# EAGLE design Main Circuit (EAGLE 9.4.2)
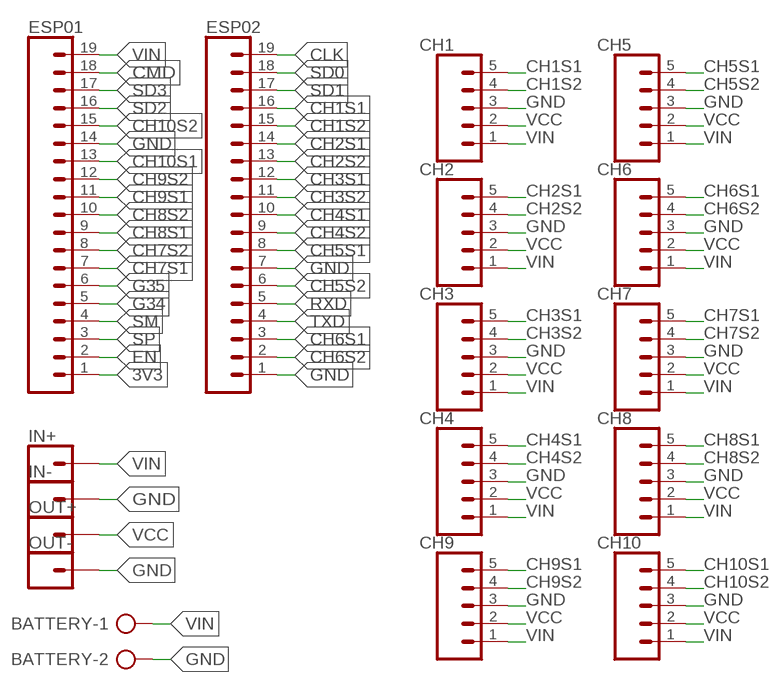
[diagram p0: schematic, sheet 1]

## Parts
BATTERY  AK500/2-H  [AK500/2-H]
CH1  CONN_05  [1X05]
CH2  CONN_05  [1X05]
CH3  CONN_05  [1X05]
CH4  CONN_05  [1X05]
CH5  CONN_05  [1X05]
CH6  CONN_05  [1X05]
CH7  CONN_05  [1X05]
CH8  CONN_05  [1X05]
CH9  CONN_05  [1X05]
CH10  CONN_05  [1X05]
ESP01  CONN_19  [1X19]
ESP02  CONN_19  [1X19]
IN+  CONN_01  [1X01]
IN-  CONN_01  [1X01]
OUT+  CONN_01  [1X01]
OUT-  CONN_01  [1X01]

## Nets
3V3: ESP01.1
CH1S1: CH1.5 ESP02.16
CH1S2: CH1.4 ESP02.15
CH2S1: CH2.5 ESP02.14
CH2S2: CH2.4 ESP02.13
CH3S1: CH3.5 ESP02.12
CH3S2: CH3.4 ESP02.11
CH4S1: CH4.5 ESP02.10
CH4S2: CH4.4 ESP02.9
CH5S1: CH5.5 ESP02.8
CH5S2: CH5.4 ESP02.6
CH6S1: CH6.5 ESP02.3
CH6S2: CH6.4 ESP02.2
CH7S1: CH7.5 ESP01.7
CH7S2: CH7.4 ESP01.8
CH8S1: CH8.5 ESP01.9
CH8S2: CH8.4 ESP01.10
CH9S1: CH9.5 ESP01.11
CH9S2: CH9.4 ESP01.12
CH10S1: CH10.5 ESP01.13
CH10S2: CH10.4 ESP01.15
CLK: ESP02.19
CMD: ESP01.18
EN: ESP01.2
G34: ESP01.5
G35: ESP01.6
GND: BATTERY.2 CH1.3 CH2.3 CH3.3 CH4.3 CH5.3 CH6.3 CH7.3 CH8.3 CH9.3 CH10.3 ESP01.14 ESP02.1 ESP02.7 IN-.1 OUT-.1
RXD: ESP02.5
SD0: ESP02.18
SD1: ESP02.17
SD2: ESP01.16
SD3: ESP01.17
SM: ESP01.4
SP: ESP01.3
TXD: ESP02.4
VCC: CH1.2 CH2.2 CH3.2 CH4.2 CH5.2 CH6.2 CH7.2 CH8.2 CH9.2 CH10.2 OUT+.1
VIN: BATTERY.1 CH1.1 CH2.1 CH3.1 CH4.1 CH5.1 CH6.1 CH7.1 CH8.1 CH9.1 CH10.1 ESP01.19 IN+.1

## Library data of the parts
BATTERY = con-ptr500:AK500/2-H: CONNECTOR Aug. 2004 / PTR Meßtechnik: Die Bezeichnung der Serie AK505 wurde geändert. Es handelt sich hierbei um AK500 in horizontaler Ausführung.; OC_FARNELL: unknown; OC_NEWARK: unknown
CH1-CH10 = SparkFun-Connectors:CONN_05: Multi connection point. Often used as Generic Header-pin footprint for 0.1 inch spaced/style header connections On any of the 0.1 inch spaced packages, you can populate with these: Break Away Headers - Straight <https://www.sparkfun.com/products/116> (PRT-00116) Break Away Male Headers - Right Angle <https://www.sparkfun.com/products/553> (PRT-00553) Female Headers <https://www.sparkfun.com/products/115> (PRT-00115) Break Away Headers - Machine Pin <https://www.sparkfun.com/products/117> (PRT-00117) Break Away Female Headers - Swiss Machine Pin <https://www.sparkfun.com/products/743> (PRT-00743) For SCREWTERMINALS and SPRING TERMINALS visit here: Screw Terimnals on SparkFun.com <https://www.sparkfun.com/search/results?term=Screw+Terminals> (5mm/3.5mm/2.54mm spacing) This device is also useful as a general connection point to wire up your design to another part of your project. Our various solder wires solder well into these plated through hole pads. Hook-Up Wire - Assortment (Stranded, 22 AWG) <https://www.sparkfun.com/products/11375> (PRT-11375) Hook-Up Wire - Assortment (Solid Core, 22 AWG) <https://www.sparkfun.com/products/11367> (PRT-11367) View the entire wire category on our website here <https://www.sparkfun.com/categories/141> Special notes: Molex polarized connector foot print use with SKU : PRT-08231 with associated crimp pins and housings. 1MM SMD Version SKU: PRT-10208
ESP01 ESP02 = SparkFun-Connectors:CONN_19: Multi connection point. Often used as Generic Header-pin footprint for 0.1 inch spaced/style header connections On any of the 0.1 inch spaced packages, you can populate with these: Break Away Headers - Straight <https://www.sparkfun.com/products/116> (PRT-00116) Break Away Male Headers - Right Angle <https://www.sparkfun.com/products/553> (PRT-00553) Female Headers <https://www.sparkfun.com/products/115> (PRT-00115) Break Away Headers - Machine Pin <https://www.sparkfun.com/products/117> (PRT-00117) Break Away Female Headers - Swiss Machine Pin <https://www.sparkfun.com/products/743> (PRT-00743) For SCREWTERMINALS and SPRING TERMINALS visit here: Screw Terimnals on SparkFun.com <https://www.sparkfun.com/search/results?term=Screw+Terminals> (5mm/3.5mm/2.54mm spacing) This device is also useful as a general connection point to wire up your design to another part of your project. Our various solder wires solder well into these plated through hole pads. Hook-Up Wire - Assortment (Stranded, 22 AWG) <https://www.sparkfun.com/products/11375> (PRT-11375) Hook-Up Wire - Assortment (Solid Core, 22 AWG) <https://www.sparkfun.com/products/11367> (PRT-11367) View the entire wire category on our website here <https://www.sparkfun.com/categories/141> Special notes: Molex polarized connector foot print use with SKU : PRT-08231 with associated crimp pins and housings. 1MM SMD Version SKU: PRT-10208 NOTES ON THE VARIANTS LOCK and LOCK_LONGPADS... This footprint was designed to help hold the alignment of a through-hole component (i.e. 6-pin header) while soldering it into place. You may notice that each hole has been shifted either up or down by 0.005 of an inch from it's more standard position (which is a perfectly straight line). This slight alteration caused the pins (the squares in the middle) to touch the edges of the holes. Because they are alternating, it causes a "brace" to hold the component in place. 0.005 has proven to be the perfect amount of "off-center" position when using our standard breakaway headers. Although looks a little odd when you look at the bare footprint, once you have a header in there, the alteration is very hard to notice. Also,if you push a header all the way into place, it is covered up entirely on the bottom side.
IN+ IN- OUT+ OUT- = SparkFun-Connectors:CONN_01: Single connection point. Often used as Generic Header-pin footprint for 0.1 inch spaced/style header connections On any of the 0.1 inch spaced packages, you can populate with these: Break Away Headers - Straight <https://www.sparkfun.com/products/116> (PRT-00116) Break Away Male Headers - Right Angle <https://www.sparkfun.com/products/553> (PRT-00553) Female Headers <https://www.sparkfun.com/products/115> (PRT-00115) Break Away Headers - Machine Pin <https://www.sparkfun.com/products/117> (PRT-00117) Break Away Female Headers - Swiss Machine Pin <https://www.sparkfun.com/products/743> (PRT-00743) This device is also useful as a general connection point to wire up your design to another part of your project. Our various solder wires solder well into these plated through hole pads. Hook-Up Wire - Assortment (Stranded, 22 AWG) <https://www.sparkfun.com/products/11375> (PRT-11375) Hook-Up Wire - Assortment (Solid Core, 22 AWG) <https://www.sparkfun.com/products/11367> (PRT-11367) View the entire wire category on our website here <https://www.sparkfun.com/categories/141> Special notes: SMTSO-256-ET is a "flush mount" nut for a 4-40 screw. We mostly use this on specialty testbeds; it is a nice way to connect hardware to your PCB at an adjustable hieght. Also note, the SNAP packages are for using a snappable style connector. We sell a baggie of snaps and they are also used on two LilyPad designs: Snap Assortment - 30 pack (male and female) <https://www.sparkfun.com/products/11347> (DEV-11347) LilyPad Arduino SimpleSnap <https://www.sparkfun.com/products/10941> (DEV-10941) LilyPad SimpleSnap Protoboard <https://www.sparkfun.com/products/10940> (DEV-10940)

## Board
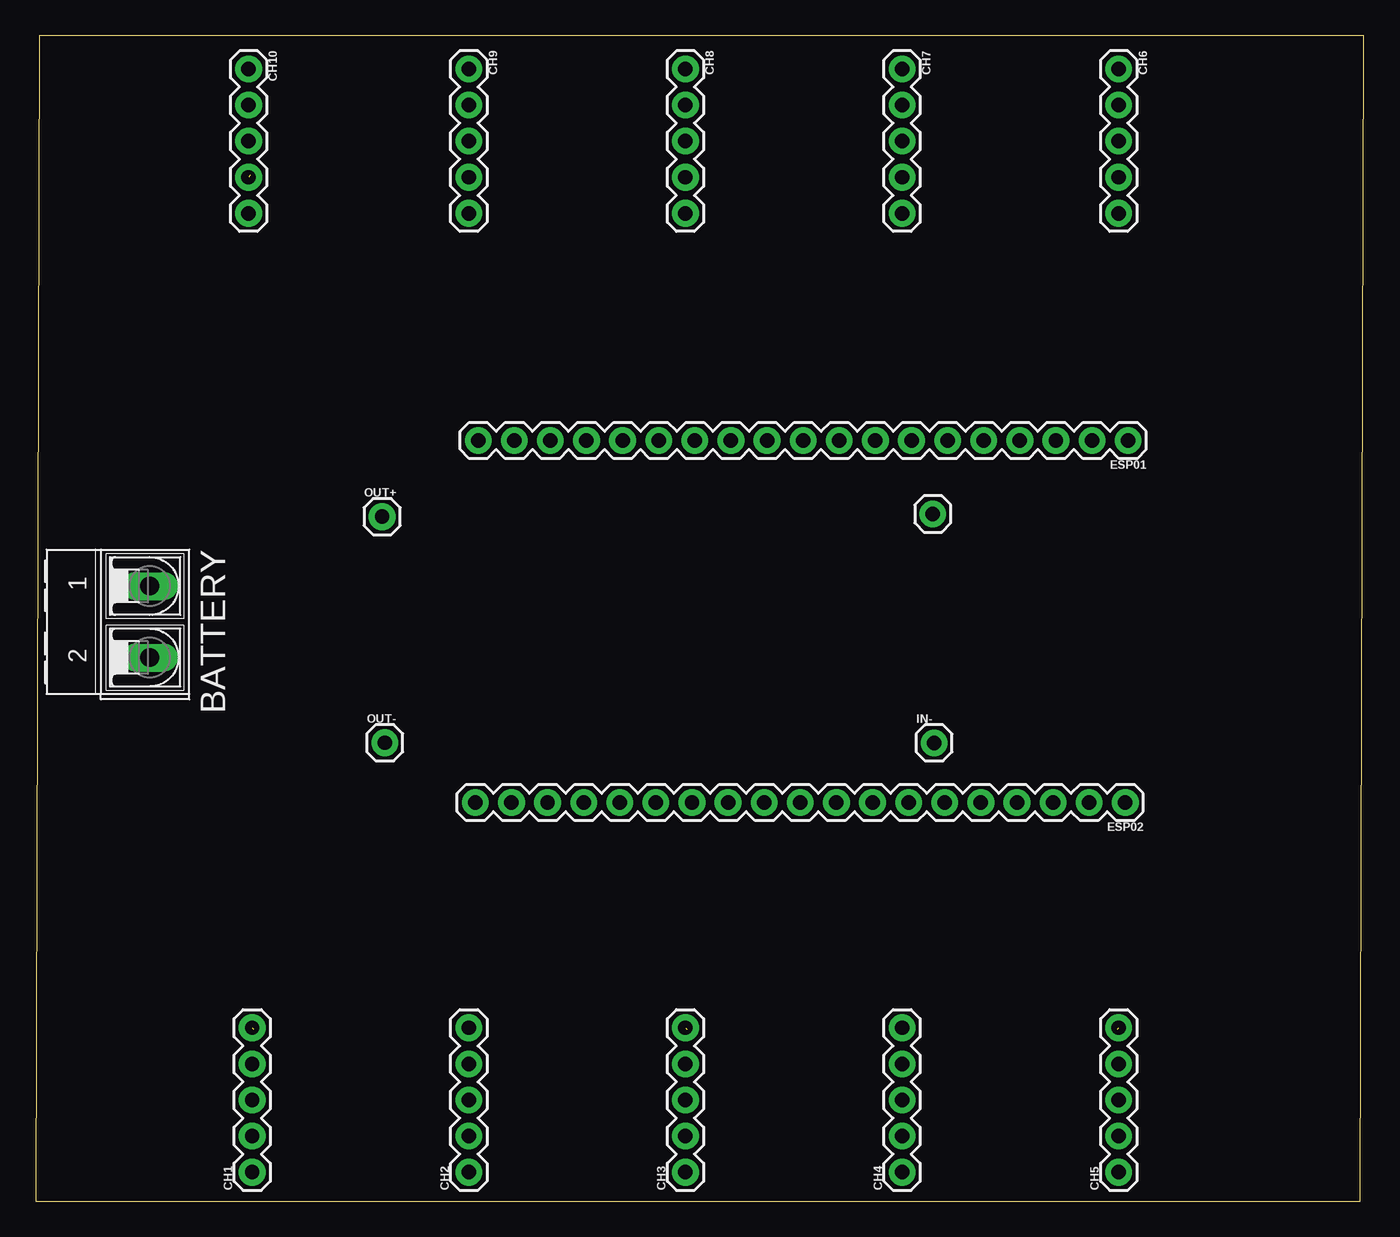
[diagram p1: board, top side]
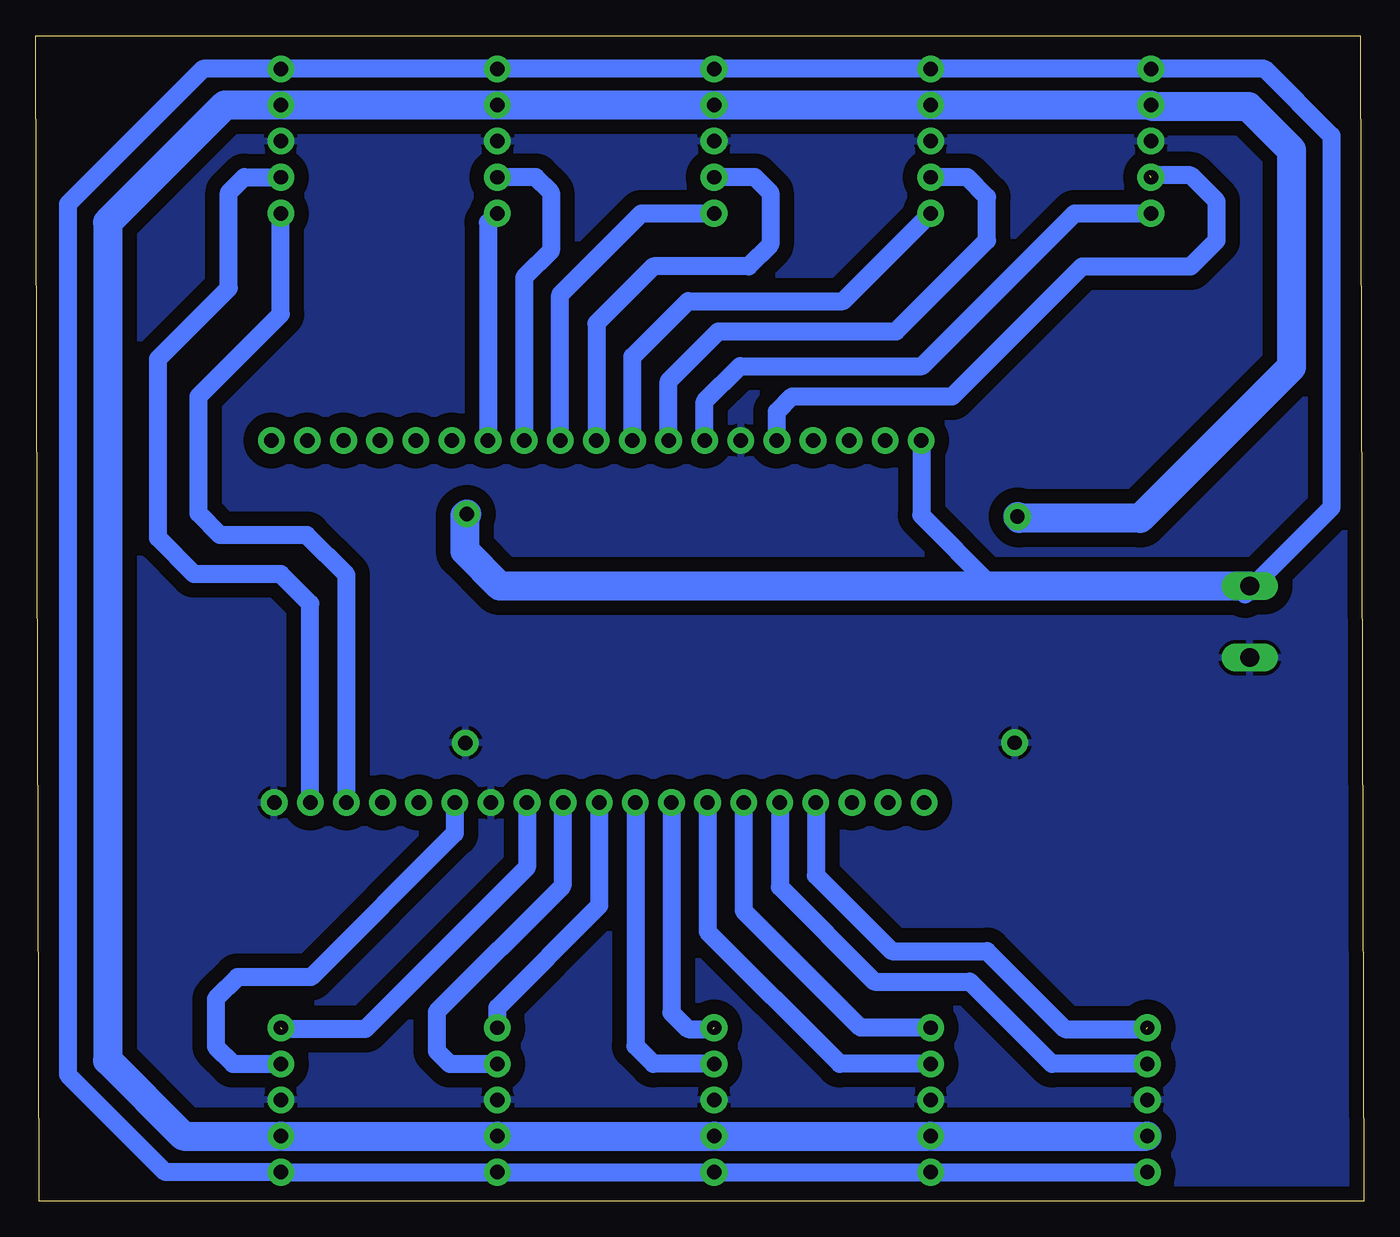
[diagram p2: board, bottom side, seen from below]

Size 93.45 x 81.97 mm. Coordinates in mm from the lower left corner, seen from the top.
Outline: 0,0 93.2,0 93.45,81.97 0.25,81.97 0,0
Copper layers (1*16): Top 0.035mm / dielectric 1.5mm / Bottom 0.035mm
Design rules "default": minimum track width 6mil, minimum drill 0.35mm, track to track 6mil, track to pad 6mil, pad to pad 6mil, via to via 6mil, smd to smd 6mil, copper to edge 40mil, drill to drill 6mil, minimum pad ring 10mil, minimum via ring 8mil, stop-mask expansion 4mil, vias tented up to drill 0mil, thermal gap 10mil

### Footprints (pad centres in the part's own frame; a part is rotated, then mirrored left to right if it is on the bottom)
AK500/2-H = drill 1.321 long: 1 -2.515,0; 2 2.515,0
1X05 = drill 1.016 pad 1.88: 1 0,0; 2 2.54,0; 3 5.08,0; 4 7.62,0; 5 10.16,0
1X19 = drill 1.016 pad 1.88: 1 0,0; 2 2.54,0; 3 5.08,0; 4 7.62,0; 5 10.16,0; 6 12.7,0; 7 15.24,0; 8 17.78,0; 9 20.32,0; 10 22.86,0; 11 25.4,0; 12 27.94,0; 13 30.48,0; 14 33.02,0; 15 35.56,0; 16 38.1,0; 17 40.64,0; 18 43.18,0; 19 45.72,0
1X01 = drill 1.016 pad 1.88: 1 0,0

### Placement (x,y rotation side)
BATTERY  8.03,40.74 270 top
CH1  15.24,2.03 90 top
CH2  30.48,2.03 90 top
CH3  45.72,2.03 90 top
CH4  60.96,2.03 90 top
CH5  76.2,2.03 90 top
CH6  76.2,79.62 270 top
CH7  60.96,79.62 270 top
CH8  45.72,79.62 270 top
CH9  30.48,79.62 270 top
CH10  14.99,79.62 270 top
ESP01  76.86,53.49 180 top
ESP02  76.66,28.03 180 top
IN+  63.12,48.32 0 top
IN-  63.21,32.22 0 top
OUT+  24.38,48.13 0 top
OUT-  24.57,32.23 0 top

### Tracks (layer width: path | path; a pad name or v marks a point on that pad's centre or on a via)
CH1S1  (1 unrouted)
  Bottom 1.27: ESP02.16 38.56,22.91 33.22,17.58 26.52,17.58 21.03,12.09 15.34,12.09
CH1S2
  Bottom 1.27: ESP02.15 41.1,22.1 34.44,15.44 27.74,15.44 21.95,9.65 CH1.4
CH2S1
  Bottom 1.27: ESP02.14 43.64,20.42 35.41,12.19 CH2.5
CH2S2
  Bottom 1.27: ESP02.13 46.18,18.95 36.88,9.65 CH2.4
CH3S1  (1 unrouted)
  Bottom 1.27: ESP02.12 48.72,13.26 47.55,12.09 45.82,12.09
CH3S2
  Bottom 1.27: ESP02.11 51.26,10.93 49.99,9.65 CH3.4
CH4S1
  Bottom 1.27: ESP02.10 53.8,20.77 60.96,13.61 CH4.5
CH4S2
  Bottom 1.27: ESP02.9 56.39,27.98 56.39,22.15 65.23,13.31 65.23,10.57 64.31,9.65 CH4.4
CH5S1  (1 unrouted)
  Bottom 1.27: ESP02.8 58.88,23.47 70.26,12.09 76.1,12.09
CH5S2
  Bottom 1.27: ESP02.6 63.96,25.85 74.07,15.75 79.25,15.75 80.77,14.22 80.77,10.87 79.55,9.65 CH5.4
CH6S1
  Bottom 1.27: ESP02.3 71.58,44.05 74.37,46.84 80.47,46.84 81.99,48.36 81.99,56.59 76.2,62.38 CH6.5
CH6S2
  Bottom 1.27: ESP02.2 74.12,42.01 76.2,44.09 82.3,44.09 84.84,46.63 84.84,59.23 79.86,64.21 79.86,70.92 78.77,72 CH6.4
CH7S1
  Bottom 1.27: ESP01.7 61.62,68.8 CH7.5
CH7S2
  Bottom 1.27: ESP01.8 59.08,64.95 57.2,66.83 57.2,70.93 58.27,72 CH7.4
CH8S1
  Bottom 1.27: ESP01.9 56.54,63.75 50.83,69.46 CH8.5
CH8S2
  Bottom 1.27: ESP01.10 54,61.72 49.99,65.73 43.28,65.73 41.76,67.26 41.76,70.92 42.84,72 CH8.4
CH9S1
  Bottom 1.27: ESP01.11 51.46,59.39 47.55,63.3 36.65,63.3 CH9.5
CH9S2
  Bottom 1.27: ESP01.12 48.92,57.66 45.41,61.16 32.92,61.16 26.52,67.56 26.52,70.61 27.91,72 CH9.4
CH10S1
  Bottom 1.27: ESP01.13 46.38,56.24 43.89,58.73 31.09,58.73 20.35,69.46 CH10.5
CH10S2  (1 unrouted)
  Bottom 1.27: ESP01.15 41.3,55.52 40.23,56.59 28.96,56.59 19.81,65.73 12.19,65.73 10.36,67.56 10.36,70.31 12.19,72.14 15.11,72.14
GND
  pour Bottom (isolate 1.016): 0,81.79 92.96,81.79 92.96,0 0,0
VCC
  Bottom 2.032: CH1.2 CH2.2 CH3.2 CH4.2 CH5.2 83.06,4.57 88.39,9.91 88.39,68.83 80.14,77.08 CH6.2 CH7.2 CH8.2 CH9.2 CH10.2 14.87,76.96 8.13,76.96 5.08,73.91 5.08,58.67 15.75,48.01 24.25,48.01 OUT+.1
VIN
  Bottom 1.27: ESP01.19 31.14,48.23 26.16,43.26 | CH1.1 CH2.1 CH3.1 CH4.1 CH5.1 84.33,2.03 91.19,8.89 91.19,70.1 81.67,79.62 CH6.1 CH7.1 CH8.1 CH9.1 CH10.1 6.98,79.62 2.29,74.93 2.29,48.77 8.38,42.67 8.38,42.9 BATTERY.1
  Bottom 2.032: BATTERY.1 26.16,43.26 60.78,43.26 63.25,45.72 63.25,48.2 IN+.1